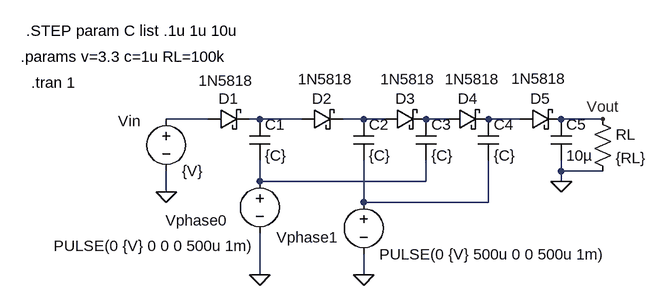
[diagram p0: schematic dickson-charge-pump.asc]
dickson-charge-pump.asc, the LTspice schematic file:
Version 4
SHEET 1 880 680
WIRE -144 96 -208 96
WIRE -64 96 -80 96
WIRE 0 96 -64 96
WIRE 96 96 64 96
WIRE 128 96 96 96
WIRE 224 96 192 96
WIRE 336 96 288 96
WIRE 464 96 400 96
WIRE 400 176 400 160
WIRE 464 176 400 176
WIRE -64 192 -64 160
WIRE 192 192 192 160
WIRE 192 192 -64 192
WIRE 400 192 400 176
WIRE -208 208 -208 176
WIRE 96 224 96 160
WIRE 288 224 288 160
WIRE 288 224 96 224
WIRE -64 336 -64 272
WIRE 96 336 96 304
FLAG 400 192 0
FLAG -64 336 0
FLAG 96 336 0
FLAG -208 208 0
FLAG 464 96 Vout
SYMBOL cap 384 96 R0
SYMATTR InstName C5
SYMATTR Value 10µ
SYMBOL cap 272 96 R0
SYMATTR InstName C4
SYMATTR Value {C}
SYMBOL cap 176 96 R0
SYMATTR InstName C3
SYMATTR Value {C}
SYMBOL cap 80 96 R0
SYMATTR InstName C2
SYMATTR Value {C}
SYMBOL cap -80 96 R0
SYMATTR InstName C1
SYMATTR Value {C}
SYMBOL schottky -144 112 R270
WINDOW 0 32 32 VTop 2
WINDOW 3 91 28 VBottom 2
SYMATTR InstName D1
SYMATTR Value 1N5818
SYMATTR Description Diode
SYMATTR Type diode
SYMBOL schottky 0 112 R270
WINDOW 0 32 32 VTop 2
WINDOW 3 93 37 VBottom 2
SYMATTR InstName D2
SYMATTR Value 1N5818
SYMATTR Description Diode
SYMATTR Type diode
SYMBOL schottky 128 112 R270
WINDOW 0 32 32 VTop 2
WINDOW 3 93 36 VBottom 2
SYMATTR InstName D3
SYMATTR Value 1N5818
SYMATTR Description Diode
SYMATTR Type diode
SYMBOL schottky 224 112 R270
WINDOW 0 32 32 VTop 2
WINDOW 3 93 39 VBottom 2
SYMATTR InstName D4
SYMATTR Value 1N5818
SYMATTR Description Diode
SYMATTR Type diode
SYMBOL schottky 336 112 R270
WINDOW 0 32 32 VTop 2
WINDOW 3 94 30 VBottom 2
SYMATTR InstName D5
SYMATTR Value 1N5818
SYMATTR Description Diode
SYMATTR Type diode
SYMBOL voltage -64 176 R0
WINDOW 3 -317 115 Left 2
WINDOW 123 0 0 Left 2
WINDOW 39 0 0 Left 2
WINDOW 0 -145 76 Left 2
SYMATTR Value PULSE(0 {V} 0 0 0 500u 1m)
SYMATTR InstName Vphase0
SYMBOL voltage 96 208 R0
WINDOW 123 0 0 Left 2
WINDOW 39 0 0 Left 2
WINDOW 0 -134 70 Left 2
SYMATTR InstName Vphase1
SYMATTR Value PULSE(0 {V} 500u 0 0 500u 1m)
SYMBOL res 448 80 R0
SYMATTR InstName RL
SYMATTR Value {RL}
SYMBOL voltage -208 80 R0
WINDOW 123 0 0 Left 2
WINDOW 39 0 0 Left 2
WINDOW 0 -74 19 Left 2
SYMATTR InstName Vin
SYMATTR Value {V}
TEXT -416 40 Left 2 !.tran 1
TEXT -432 0 Left 2 !.params v=3.3 c=1u RL=100k
TEXT -424 -40 Left 2 !.STEP param C list .1u 1u 10u

The netlist it stands for:
* dickson-charge-pump.asc
C5 Vout 0 10µ
C4 N005 N007 {C}
C3 N004 N006 {C}
C2 N003 N007 {C}
C1 N002 N006 {C}
D1 N001 N002 1N5818
D2 N002 N003 1N5818
D3 N003 N004 1N5818
D4 N004 N005 1N5818
D5 N005 Vout 1N5818
Vphase0 N006 0 PULSE(0 {V} 0 0 0 500u 1m)
Vphase1 N007 0 PULSE(0 {V} 500u 0 0 500u 1m)
RL Vout 0 {RL}
Vin N001 0 {V}
.model D D
.lib standard.dio
.tran 1
.params v=3.3 c=1u RL=100k
.STEP param C list .1u 1u 10u
.backanno
.end